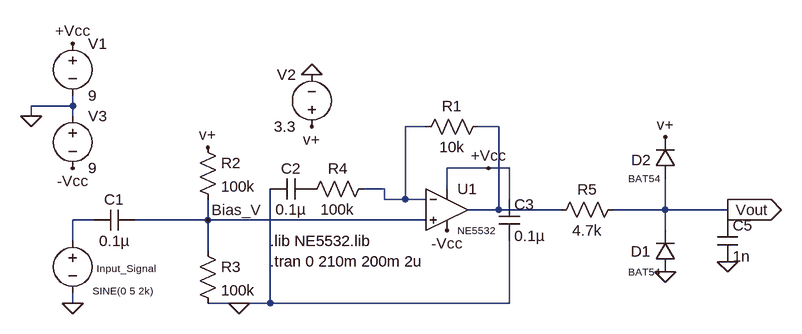
[diagram p0: schematic levelshifter+adc_protect.asc]
levelshifter+adc_protect.asc, the LTspice schematic file:
Version 4.1
SHEET 1 1284 680
WIRE -96 -32 -96 -48
WIRE -96 -32 -160 -32
WIRE -160 -16 -160 -32
WIRE -96 -16 -96 -32
WIRE 448 0 416 0
WIRE 560 0 528 0
WIRE 544 64 480 64
WIRE 576 64 544 64
WIRE 384 96 352 96
WIRE 480 96 480 64
WIRE 384 112 384 96
WIRE 416 112 416 0
WIRE 416 112 384 112
WIRE 448 112 416 112
WIRE 576 112 576 64
WIRE 560 128 560 0
WIRE 560 128 512 128
WIRE 656 128 560 128
WIRE 816 128 816 80
WIRE 816 128 736 128
WIRE 912 128 816 128
WIRE -64 144 -96 144
WIRE 112 144 112 112
WIRE 112 144 0 144
WIRE 448 144 112 144
WIRE 912 144 912 128
WIRE 816 160 816 128
WIRE -96 176 -96 144
WIRE 112 192 112 144
WIRE -96 272 -96 256
WIRE 160 272 112 272
WIRE 208 272 208 96
WIRE 208 272 160 272
WIRE 576 272 576 176
WIRE 576 272 208 272
FLAG -96 272 0
FLAG 912 128 Vout
IOPIN 912 128 Out
FLAG 272 -80 0
FLAG 272 0 v+
FLAG 112 32 v+
FLAG 160 272 0
FLAG 112 144 Bias_V
FLAG -160 -16 0
FLAG -96 -128 +Vcc
FLAG 544 64 +Vcc
FLAG -96 64 -Vcc
FLAG 480 160 -Vcc
FLAG 816 16 v+
FLAG 816 224 0
FLAG 912 208 0
SYMBOL voltage -96 160 R0
WINDOW 0 37 58 Left 1
WINDOW 3 31 93 Left 1
WINDOW 123 19 119 Left 1
WINDOW 39 0 0 Left 0
SYMATTR InstName Input_Signal
SYMATTR Value SINE(0 5 2k)
SYMBOL voltage 272 16 R180
WINDOW 0 24 96 Left 2
WINDOW 3 24 16 Left 2
WINDOW 123 0 0 Left 0
WINDOW 39 0 0 Left 0
SYMATTR InstName V2
SYMATTR Value 3.3
SYMBOL res 544 -16 R90
WINDOW 0 0 56 VBottom 2
WINDOW 3 32 56 VTop 2
SYMATTR InstName R1
SYMATTR Value 10k
SYMBOL res 368 80 R90
WINDOW 0 0 56 VBottom 2
WINDOW 3 32 56 VTop 2
SYMATTR InstName R4
SYMATTR Value 100k
SYMBOL cap 0 128 R90
WINDOW 0 0 32 VBottom 2
WINDOW 3 32 32 VTop 2
SYMATTR InstName C1
SYMATTR Value 0.1µ
SYMBOL res 96 16 R0
SYMATTR InstName R2
SYMATTR Value 100k
SYMBOL res 96 176 R0
SYMATTR InstName R3
SYMATTR Value 100k
SYMBOL cap 272 80 R90
WINDOW 0 0 32 VBottom 2
WINDOW 3 32 32 VTop 2
SYMATTR InstName C2
SYMATTR Value 0.1µ
SYMBOL cap 560 112 R0
SYMATTR InstName C3
SYMATTR Value 0.1µ
SYMBOL OpAmps\\opamp2 480 64 R0
WINDOW 3 16 96 Left 1
SYMATTR InstName U1
SYMATTR Value NE5532
SYMBOL voltage -96 -144 R0
WINDOW 123 0 0 Left 0
WINDOW 39 0 0 Left 0
SYMATTR InstName V1
SYMATTR Value 9
SYMBOL voltage -96 -32 R0
WINDOW 123 0 0 Left 0
WINDOW 39 0 0 Left 0
SYMATTR InstName V3
SYMATTR Value 9
SYMBOL cap 896 144 R0
SYMATTR InstName C5
SYMATTR Value 1n
SYMBOL diode 832 224 R180
WINDOW 0 38 32 Left 2
WINDOW 3 24 0 Left 1
SYMATTR InstName D1
SYMATTR Value BAT54
SYMATTR Description Diode
SYMATTR Type diode
SYMBOL diode 832 80 R180
WINDOW 0 37 29 Left 2
WINDOW 3 24 0 Left 1
SYMATTR InstName D2
SYMATTR Value BAT54
SYMATTR Description Diode
SYMATTR Type diode
SYMBOL res 640 144 R270
WINDOW 0 32 56 VTop 2
WINDOW 3 0 56 VBottom 2
SYMATTR InstName R5
SYMATTR Value 4.7k
TEXT 208 176 Left 2 !.lib NE5532.lib\n.tran 0 210m 200m 2u

The netlist it stands for:
* levelshifter+adc_protect.asc
V§Input_Signal N003 0 SINE(0 5 2k)
V2 v+ 0 3.3
R1 N002 N001 10k
R4 N001 P001 100k
C1 Bias_V N003 0.1µ
R2 v+ Bias_V 100k
R3 Bias_V 0 100k
C2 P001 0 0.1µ
C3 +Vcc 0 0.1µ
X§U1 Bias_V N001 +Vcc -Vcc N002 NE5532  ; pins In+ In- V+ V- OUT
V1 +Vcc 0 9
V3 0 -Vcc 9
C5 Vout 0 1n
D1 0 Vout BAT54
D2 Vout v+ BAT54
R5 N002 Vout 4.7k
.model D D
.lib standard.dio
.lib NE5532.lib
.tran 0 210m 200m 2u
.backanno
.end